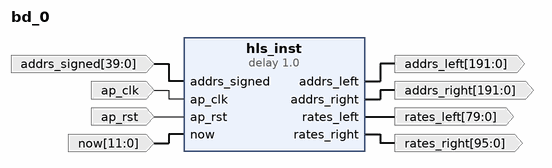
[diagram p0: block diagram of the top level]
# Vivado block design bd_0, xc7z020clg400-2, Vivado 2024.1
create_bd_design bd_0

create_bd_port -dir O -from 191 -to 0 -type data addrs_left
create_bd_port -dir O -from 191 -to 0 -type data addrs_right
create_bd_port -dir I -from 39 -to 0 -type data addrs_signed
create_bd_port -dir I -type clk ap_clk
set_property -dict {CONFIG.FREQ_HZ 359000000.0} [get_bd_ports ap_clk]
create_bd_port -dir I -type rst ap_rst
set_property -dict {CONFIG.POLARITY ACTIVE_HIGH} [get_bd_ports ap_rst]
create_bd_port -dir I -from 11 -to 0 -type data now
create_bd_port -dir O -from 79 -to 0 -type data rates_left
create_bd_port -dir O -from 95 -to 0 -type data rates_right

create_bd_cell -type ip -vlnv xilinx.com:hls:delay:1.0 hls_inst

# ---- connections ----

connect_bd_net -net addrs_signed_0_1 [get_bd_ports addrs_signed] [get_bd_pins hls_inst/addrs_signed]
connect_bd_net -net ap_clk_0_1 [get_bd_ports ap_clk] [get_bd_pins hls_inst/ap_clk]
connect_bd_net -net ap_rst_0_1 [get_bd_ports ap_rst] [get_bd_pins hls_inst/ap_rst]
connect_bd_net [get_bd_pins hls_inst/addrs_left] [get_bd_ports addrs_left]
connect_bd_net [get_bd_pins hls_inst/addrs_right] [get_bd_ports addrs_right]
connect_bd_net [get_bd_pins hls_inst/rates_left] [get_bd_ports rates_left]
connect_bd_net [get_bd_pins hls_inst/rates_right] [get_bd_ports rates_right]
connect_bd_net -net now_0_1 [get_bd_ports now] [get_bd_pins hls_inst/now]

validate_bd_design
save_bd_design
